# Altium schematic sheet DashDAP.SchDoc
size 292 x 193 mm; Author: Power Lin; DocumentNumber: 1; SheetNumber: 1; SheetTotal: 4; Website: wiki-power.com
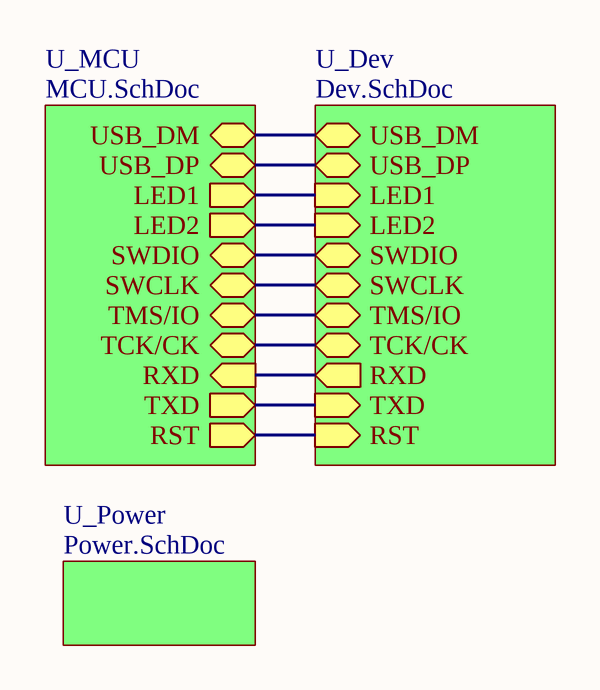
[diagram p0: DashDAP.SchDoc]

## Sub-sheets
U_Dev = Dev.SchDoc: USB_DM (bidir), USB_DP (bidir), LED1 (in), LED2 (in), SWDIO (bidir), SWCLK (bidir), TMS/IO (bidir), TCK/CK (bidir), TXD (in), RXD (out), RST (in)
U_MCU = MCU.SchDoc: LED1 (out), LED2 (out), TMS/IO (bidir), TCK/CK (bidir), RST (out), TXD (out), RXD (in), USB_DM (bidir), USB_DP (bidir), SWDIO (bidir), SWCLK (bidir)
U_Power = Power.SchDoc: no entries

## Nets
(unnamed): sheet U_MCU/LED1, sheet U_Dev/LED1
(unnamed): sheet U_MCU/LED2, sheet U_Dev/LED2
(unnamed): sheet U_MCU/TMS/IO, sheet U_Dev/TMS/IO
(unnamed): sheet U_MCU/TCK/CK, sheet U_Dev/TCK/CK
(unnamed): sheet U_MCU/RST, sheet U_Dev/RST
(unnamed): sheet U_MCU/TXD, sheet U_Dev/TXD
(unnamed): sheet U_MCU/RXD, sheet U_Dev/RXD
(unnamed): sheet U_MCU/USB_DM, sheet U_Dev/USB_DM
(unnamed): sheet U_MCU/USB_DP, sheet U_Dev/USB_DP
(unnamed): sheet U_MCU/SWDIO, sheet U_Dev/SWDIO
(unnamed): sheet U_MCU/SWCLK, sheet U_Dev/SWCLK

## Notes on the sheet
- Author
- DocumentName
- ModifiedDate
- ProjectName
- SheetNumber
- SheetTotal
- Website
- Revision